# Altium schematic sheet 15fpga.SchDoc
size C
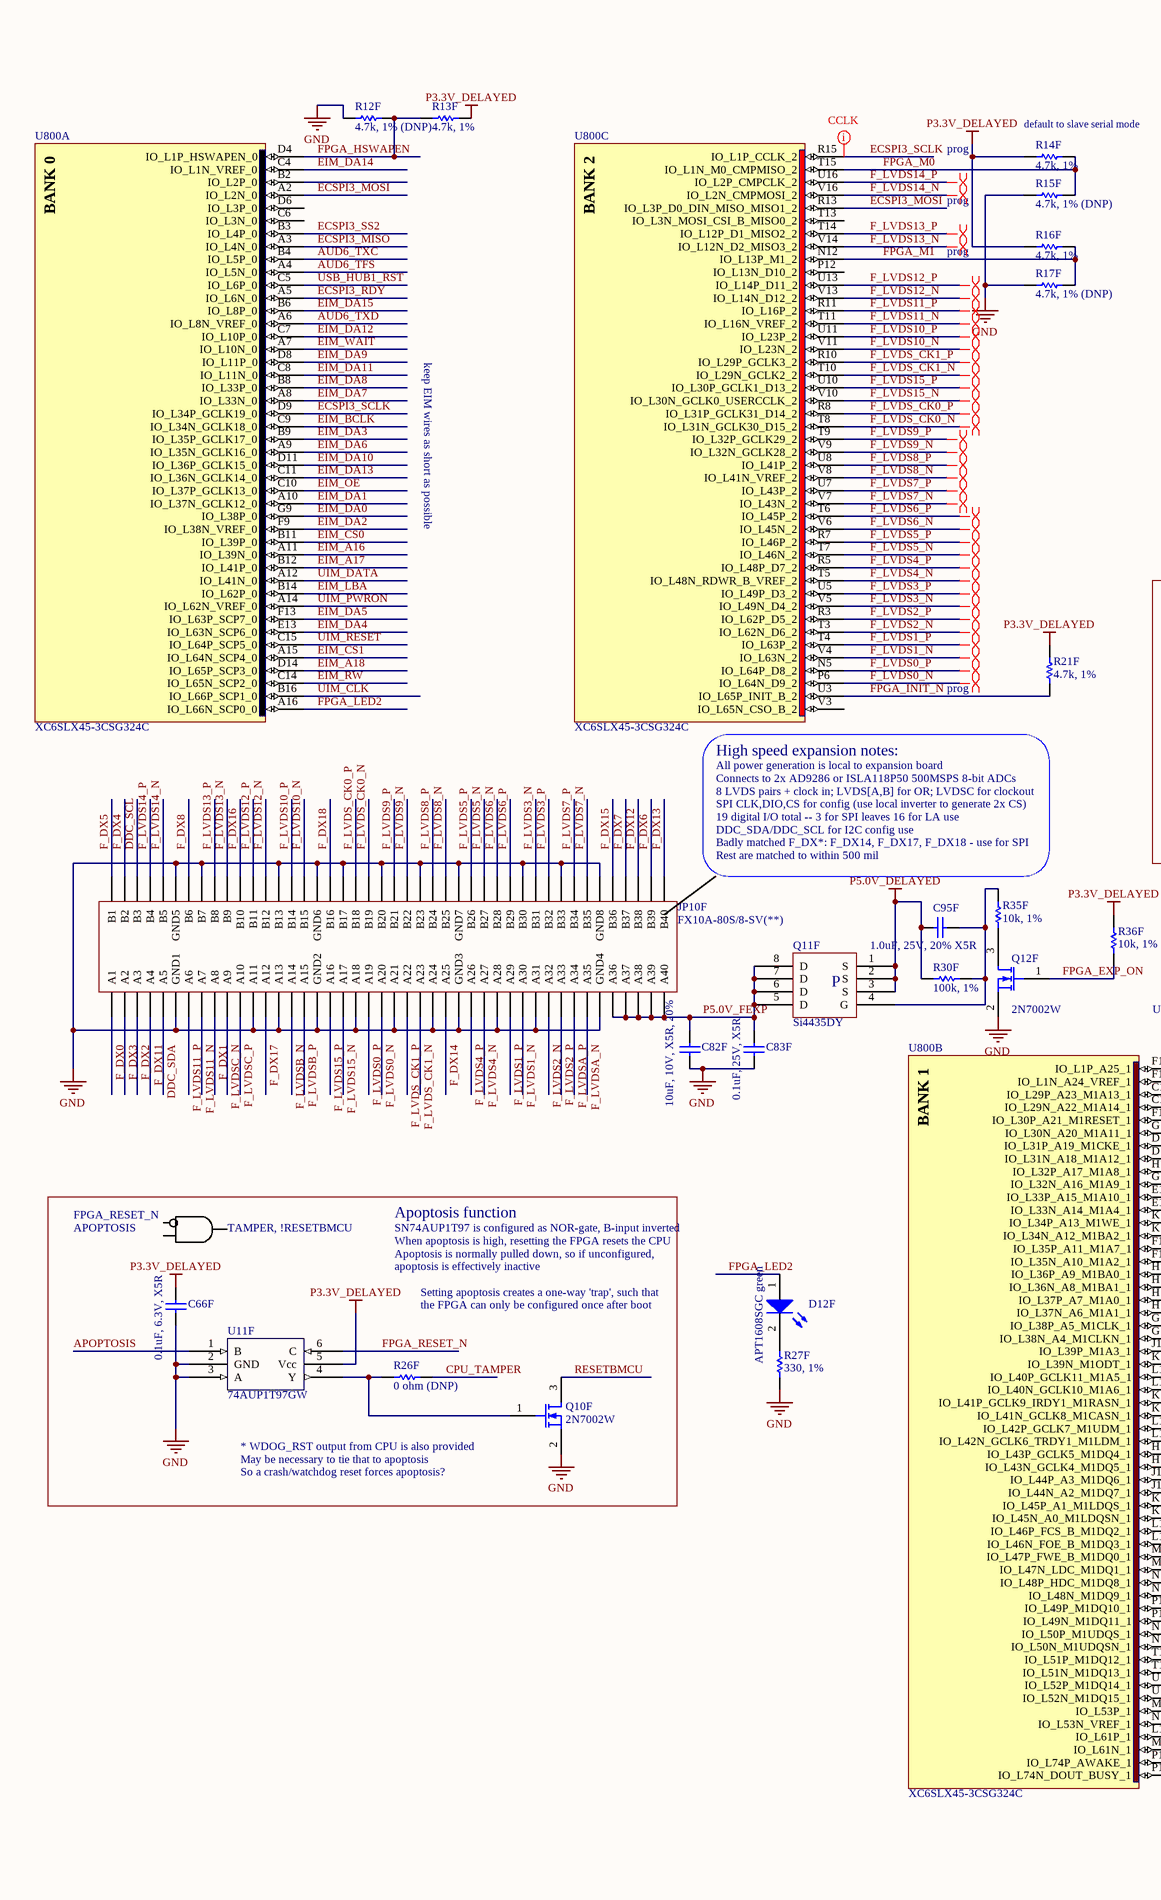
[diagram p0: 15fpga.SchDoc, left]
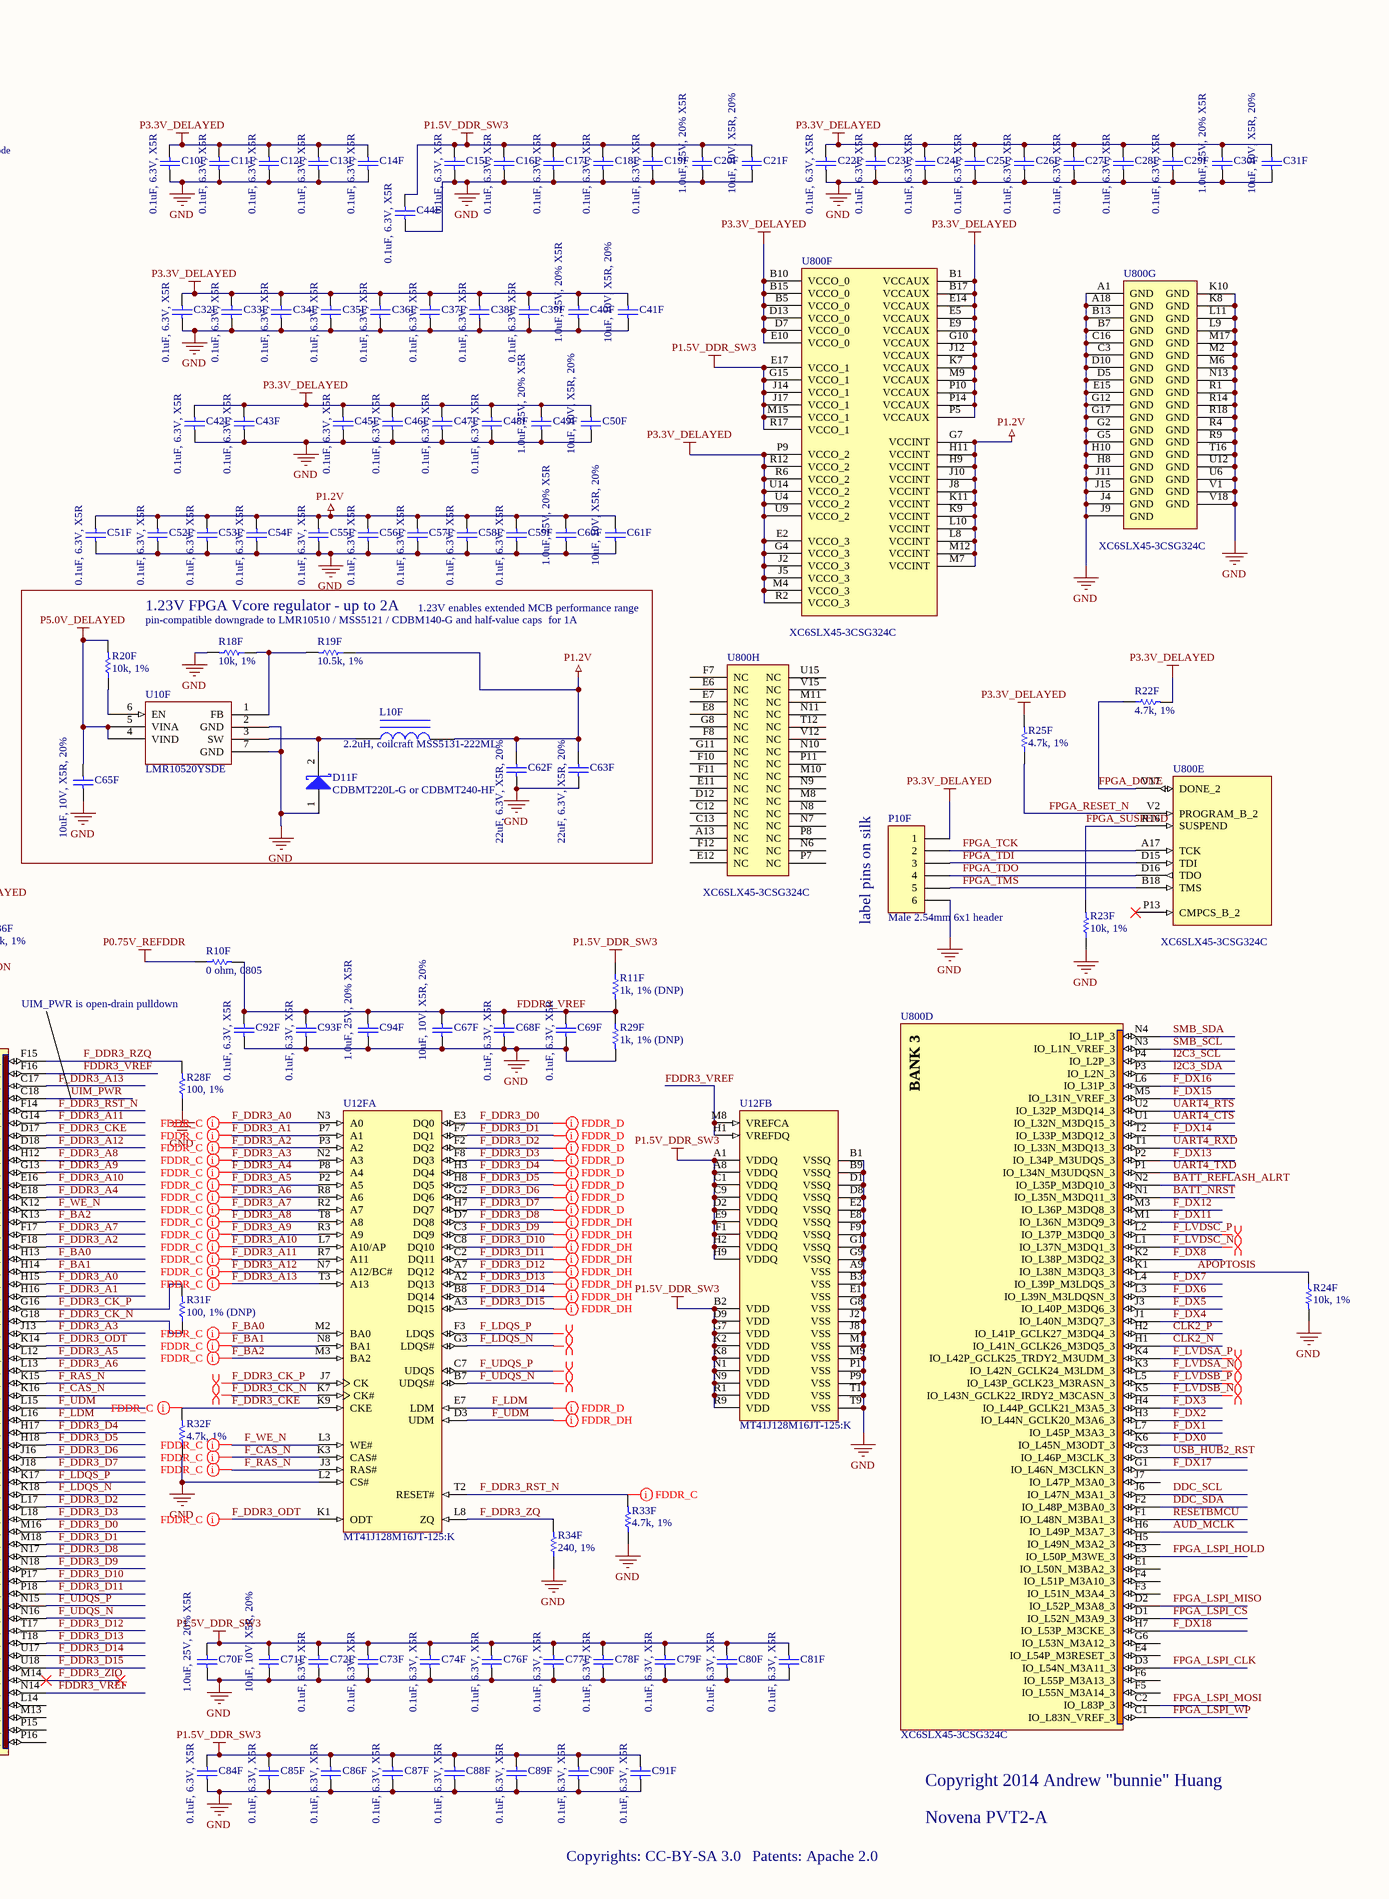
[diagram p1: 15fpga.SchDoc, right]

## Parts
C10F  0.1uF, 6.3V, X5R  [CAPC0603N_B]
C11F  0.1uF, 6.3V, X5R  [CAPC0603N_B]
C12F  0.1uF, 6.3V, X5R  [CAPC0603N_B]
C13F  0.1uF, 6.3V, X5R  [CAPC0603N_B]
C14F  0.1uF, 6.3V, X5R  [CAPC0603N_B]
C15F  0.1uF, 6.3V, X5R  [CAPC0603N_B]
C16F  0.1uF, 6.3V, X5R  [CAPC0603N_B]
C17F  0.1uF, 6.3V, X5R  [CAPC0603N_B]
C18F  0.1uF, 6.3V, X5R  [CAPC0603N_B]
C19F  0.1uF, 6.3V, X5R  [CAPC0603N_B]
C20F  1.0uF, 25V, 20% X5R  [CAPC1608N]
C21F  10uF, 10V, X5R, 20%  [CAPC1608N]
C22F  0.1uF, 6.3V, X5R  [CAPC0603N_B]
C23F  0.1uF, 6.3V, X5R  [CAPC0603N_B]
C24F  0.1uF, 6.3V, X5R  [CAPC0603N_B]
C25F  0.1uF, 6.3V, X5R  [CAPC0603N_B]
C26F  0.1uF, 6.3V, X5R  [CAPC0603N_B]
C27F  0.1uF, 6.3V, X5R  [CAPC0603N_B]
C28F  0.1uF, 6.3V, X5R  [CAPC0603N_B]
C29F  0.1uF, 6.3V, X5R  [CAPC0603N_B]
C30F  1.0uF, 25V, 20% X5R  [CAPC1608N]
C31F  10uF, 10V, X5R, 20%  [CAPC1608N]
C32F  0.1uF, 6.3V, X5R  [CAPC0603N_B]
C33F  0.1uF, 6.3V, X5R  [CAPC0603N_B]
C34F  0.1uF, 6.3V, X5R  [CAPC0603N_B]
C35F  0.1uF, 6.3V, X5R  [CAPC0603N_B]
C36F  0.1uF, 6.3V, X5R  [CAPC0603N_B]
C37F  0.1uF, 6.3V, X5R  [CAPC0603N_B]
C38F  0.1uF, 6.3V, X5R  [CAPC0603N_B]
C39F  0.1uF, 6.3V, X5R  [CAPC0603N_B]
C40F  1.0uF, 25V, 20% X5R  [CAPC1608N]
C41F  10uF, 10V, X5R, 20%  [CAPC1608N]
C42F  0.1uF, 6.3V, X5R  [CAPC0603N_B]
C43F  0.1uF, 6.3V, X5R  [CAPC0603N_B]
C44F  0.1uF, 6.3V, X5R  [CAPC0603N_B]
C45F  0.1uF, 6.3V, X5R  [CAPC0603N_B]
C46F  0.1uF, 6.3V, X5R  [CAPC0603N_B]
C47F  0.1uF, 6.3V, X5R  [CAPC0603N_B]
C48F  0.1uF, 6.3V, X5R  [CAPC0603N_B]
C49F  1.0uF, 25V, 20% X5R  [CAPC1608N]
C50F  10uF, 10V, X5R, 20%  [CAPC1608N]
C51F  0.1uF, 6.3V, X5R  [CAPC0603N_B]
C52F  0.1uF, 6.3V, X5R  [CAPC0603N_B]
C53F  0.1uF, 6.3V, X5R  [CAPC0603N_B]
C54F  0.1uF, 6.3V, X5R  [CAPC0603N_B]
C55F  0.1uF, 6.3V, X5R  [CAPC0603N_B]
C56F  0.1uF, 6.3V, X5R  [CAPC0603N_B]
C57F  0.1uF, 6.3V, X5R  [CAPC0603N_B]
C58F  0.1uF, 6.3V, X5R  [CAPC0603N_B]
C59F  0.1uF, 6.3V, X5R  [CAPC0603N_B]
C60F  1.0uF, 25V, 20% X5R  [CAPC1608N]
C61F  10uF, 10V, X5R, 20%  [CAPC1608N]
C62F  22uF, 6.3V, X5R, 20%  [CAPC1608N_HD]
C63F  22uF, 6.3V, X5R, 20%  [CAPC1608N_HD]
C65F  10uF, 10V, X5R, 20%  [CAPC1608N]
C66F  0.1uF, 6.3V, X5R  [CAPC0603N_B]
C67F  10uF, 10V, X5R, 20%  [CAPC1608N]
C68F  0.1uF, 6.3V, X5R  [CAPC0603N_B]
C69F  0.1uF, 6.3V, X5R  [CAPC0603N_B]
C70F  1.0uF, 25V, 20% X5R  [CAPC1608N]
C71F  10uF, 10V, X5R, 20%  [CAPC1608N]
C72F  0.1uF, 6.3V, X5R  [CAPC0603N_B]
C73F  0.1uF, 6.3V, X5R  [CAPC0603N_B]
C74F  0.1uF, 6.3V, X5R  [CAPC0603N_B]
C76F  0.1uF, 6.3V, X5R  [CAPC0603N_B]
C77F  0.1uF, 6.3V, X5R  [CAPC0603N_B]
C78F  0.1uF, 6.3V, X5R  [CAPC0603N_B]
C79F  0.1uF, 6.3V, X5R  [CAPC0603N_B]
C80F  0.1uF, 6.3V, X5R  [CAPC0603N_B]
C81F  0.1uF, 6.3V, X5R  [CAPC0603N_B]
C82F  10uF, 10V, X5R, 20%  [CAPC1608N]
C83F  0.1uF, 25V, X5R  [CAPC1005N]
C84F  0.1uF, 6.3V, X5R  [CAPC0603N_B]
C85F  0.1uF, 6.3V, X5R  [CAPC0603N_B]
C86F  0.1uF, 6.3V, X5R  [CAPC0603N_B]
C87F  0.1uF, 6.3V, X5R  [CAPC0603N_B]
C88F  0.1uF, 6.3V, X5R  [CAPC0603N_B]
C89F  0.1uF, 6.3V, X5R  [CAPC0603N_B]
C90F  0.1uF, 6.3V, X5R  [CAPC0603N_B]
C91F  0.1uF, 6.3V, X5R  [CAPC0603N_B]
C92F  0.1uF, 6.3V, X5R  [CAPC0603N_B]
C93F  0.1uF, 6.3V, X5R  [CAPC0603N_B]
C94F  1.0uF, 25V, 20% X5R  [CAPC1608N]
C95F  1.0uF, 25V, 20% X5R  [CAPC1608N]
D11F  CDBMT220L-G or CDBMT240-HF  [SOD123]
D12F  APT1608SGC green  [CD1608-0603]
JP10F  FX10A-80S/8-SV(**)  [HRS_FX10A-80S/8-SV1(**)]
L10F  2.2uH, coilcraft MSS5131-222ML  [COILCRAFT_MSS5121]
P10F  Male 2.54mm 6x1 header  [HDR1X6]
Q10F  2N7002W  [SOT323-3AN]
Q11F  Si4435DY  [SOIC127P600-8AN]
Q12F  2N7002W  [SOT323-3AN]
R10F  0 ohm, 0805  [RESC2012N]
R11F  1k, 1% (DNP)  [RESC1005N]
R12F  4.7k, 1% (DNP)  [RESC1005N]
R13F  4.7k, 1%  [RESC1005N]
R14F  4.7k, 1%  [RESC1005N]
R15F  4.7k, 1% (DNP)  [RESC1005N]
R16F  4.7k, 1%  [RESC1005N]
R17F  4.7k, 1% (DNP)  [RESC1005N]
R18F  10k, 1%  [RESC1005N]
R19F  10.5k, 1%  [RESC1005N]
R20F  10k, 1%  [RESC1005N]
R21F  4.7k, 1%  [RESC1005N]
R22F  4.7k, 1%  [RESC1005N]
R23F  10k, 1%  [RESC1005N]
R24F  10k, 1%  [RESC1005N]
R25F  4.7k, 1%  [RESC1005N]
R26F  0 ohm (DNP)  [RESC1005N]
R27F  330, 1%  [RESC1005N]
R28F  100, 1%  [RESC1005N]
R29F  1k, 1% (DNP)  [RESC1005N]
R30F  100k, 1%  [RESC1005N]
R31F  100, 1% (DNP)  [RESC1005N]
R32F  4.7k, 1%  [RESC1005N]
R33F  4.7k, 1%  [RESC1005N]
R34F  240, 1%  [RESC1005N]
R35F  10k, 1%  [RESC1005N]
R36F  10k, 1%  [RESC1005N]
U10F  LMR10520YSDE  [SON95P300X300X80-7V]
U11F  74AUP1T97GW  [SOT363-6N]
U12F  MT41J128M16JT-125:K  [MICT-HA-96]  (parts A,B of 3)
U800  XC6SLX45-3CSG324C  [CSG324]  (parts A,B,C,D,E,F,G,H of 8)

## Blocks framed on the sheet
1.23V FPGA Vcore regulator - up to 2A: C62F C63F C65F D11F L10F R18F R19F R20F U10F
Apoptosis function: C66F Q10F R26F U11F

## Nets
GND: C10F.2 C11F.2 C12F.2 C13F.2 C14F.2 C15F.2 C16F.2 C17F.2 C18F.2 C19F.2 C20F.1 C21F.2 C22F.2 C23F.2 C24F.2 C25F.2 C26F.2 C27F.2 C28F.2 C29F.2 C30F.1 C31F.2 C32F.2 C33F.2 C34F.2 C35F.2 C36F.2 C37F.2 C38F.2 C39F.2 C40F.1 C41F.2 C42F.2 C43F.2 C44F.2 C45F.2 C46F.2 C47F.2 C48F.2 C49F.1 C50F.2 C51F.2 C52F.2 C53F.2 C54F.2 C55F.2 C56F.2 C57F.2 C58F.2 C59F.2 C60F.1 C61F.2 C62F.2 C63F.2 C65F.1 C66F.2 C67F.2 C68F.2 C69F.2 C70F.1 C71F.2 C72F.2 C73F.2 C74F.2 C76F.2 C77F.2 C78F.2 C79F.2 C80F.2 C81F.2 C82F.1 C83F.2 C84F.2 C85F.2 C86F.2 C87F.2 C88F.2 C89F.2 C90F.2 C91F.2 C92F.2 C93F.2 C94F.1 D11F.1(A) JP10F.A11 JP10F.A13 JP10F.A18 JP10F.A21 JP10F.A24 JP10F.A28 JP10F.A31 JP10F.B7 JP10F.B13 JP10F.B17 JP10F.B20 JP10F.B23 JP10F.B30 JP10F.B33 JP10F.GND1 JP10F.GND2 JP10F.GND3 JP10F.GND4 JP10F.GND5 JP10F.GND6 JP10F.GND7 JP10F.GND8 P10F.6 Q10F.2(S) Q12F.2(S) R12F.1 R15F.1 R17F.1 R18F.2 R23F.1 R24F.2 R27F.1 R28F.1 R29F.2 R32F.1 R33F.1 R34F.1 U10F.2(GND) U10F.7(GND) U11F.2(GND) U11F.3(A) U12F.A9(VSS) U12F.B1(VSSQ) U12F.B3(VSS) U12F.B9(VSSQ) U12F.D1(VSSQ) U12F.D8(VSSQ) U12F.E1(VSS) U12F.E2(VSSQ) U12F.E8(VSSQ) U12F.F9(VSSQ) U12F.G1(VSSQ) U12F.G8(VSS) U12F.G9(VSSQ) U12F.J2(VSS) U12F.J8(VSS) U12F.L2(CS#) U12F.M1(VSS) U12F.M9(VSS) U12F.P1(VSS) U12F.P9(VSS) U12F.T1(VSS) U12F.T9(VSS) U800.A1(GND) U800.A18(GND) U800.B7(GND) U800.B13(GND) U800.C3(GND) U800.C16(GND) U800.D5(GND) U800.D10(GND) U800.E15(GND) U800.G2(GND) U800.G5(GND) U800.G12(GND) U800.G17(GND) U800.H8(GND) U800.H10(GND) U800.J4(GND) U800.J9(GND) U800.J11(GND) U800.J15(GND) U800.K8(GND) U800.K10(GND) U800.L9(GND) U800.L11(GND) U800.M2(GND) U800.M6(GND) U800.M17(GND) U800.N13(GND) U800.R1(GND) U800.R4(GND) U800.R9(GND) U800.R14(GND) U800.R18(GND) U800.T16(GND) U800.U6(GND) U800.U12(GND) U800.V1(GND) U800.V18(GND)
P0.75V_REFDDR: R10F.1
P1.2V: C51F.1 C52F.1 C53F.1 C54F.1 C55F.1 C56F.1 C57F.1 C58F.1 C59F.1 C60F.2 C61F.1 C62F.1 C63F.1 L10F.2 R19F.1 U800.G7(VCCINT) U800.H9(VCCINT) U800.H11(VCCINT) U800.J8(VCCINT) U800.J10(VCCINT) U800.K9(VCCINT) U800.K11(VCCINT) U800.L8(VCCINT) U800.L10(VCCINT) U800.M7(VCCINT) U800.M12(VCCINT)
P1.5V_DDR_SW3: C15F.1 C16F.1 C17F.1 C18F.1 C19F.1 C20F.2 C21F.1 C44F.1 C70F.2 C71F.1 C72F.1 C73F.1 C74F.1 C76F.1 C77F.1 C78F.1 C79F.1 C80F.1 C81F.1 C84F.1 C85F.1 C86F.1 C87F.1 C88F.1 C89F.1 C90F.1 C91F.1 R11F.1 U12F.A1(VDDQ) U12F.A8(VDDQ) U12F.B2(VDD) U12F.C1(VDDQ) U12F.C9(VDDQ) U12F.D2(VDDQ) U12F.D9(VDD) U12F.E9(VDDQ) U12F.F1(VDDQ) U12F.G7(VDD) U12F.H2(VDDQ) U12F.H9(VDDQ) U12F.K2(VDD) U12F.K8(VDD) U12F.N1(VDD) U12F.N9(VDD) U12F.R1(VDD) U12F.R9(VDD) U800.E17(VCCO_1) U800.G15(VCCO_1) U800.J14(VCCO_1) U800.J17(VCCO_1) U800.M15(VCCO_1) U800.R17(VCCO_1)
P3.3V_DELAYED: C10F.1 C11F.1 C12F.1 C13F.1 C14F.1 C22F.1 C23F.1 C24F.1 C25F.1 C26F.1 C27F.1 C28F.1 C29F.1 C30F.2 C31F.1 C32F.1 C33F.1 C34F.1 C35F.1 C36F.1 C37F.1 C38F.1 C39F.1 C40F.2 C41F.1 C42F.1 C43F.1 C45F.1 C46F.1 C47F.1 C48F.1 C49F.2 C50F.1 C66F.1 P10F.1 R13F.2 R14F.1 R16F.1 R21F.1 R22F.2 R25F.2 R36F.1 U11F.5(Vcc) U800.B1(VCCAUX) U800.B5(VCCO_0) U800.B10(VCCO_0) U800.B15(VCCO_0) U800.B17(VCCAUX) U800.D7(VCCO_0) U800.D13(VCCO_0) U800.E2(VCCO_3) U800.E5(VCCAUX) U800.E9(VCCAUX) U800.E10(VCCO_0) U800.E14(VCCAUX) U800.G4(VCCO_3) U800.G10(VCCAUX) U800.J2(VCCO_3) U800.J5(VCCO_3) U800.J12(VCCAUX) U800.K7(VCCAUX) U800.M4(VCCO_3) U800.M9(VCCAUX) U800.P5(VCCAUX) U800.P9(VCCO_2) U800.P10(VCCAUX) U800.P14(VCCAUX) U800.R2(VCCO_3) U800.R6(VCCO_2) U800.R12(VCCO_2) U800.U4(VCCO_2) U800.U9(VCCO_2) U800.U14(VCCO_2)
P5.0V_DELAYED: C65F.2 C95F.1 Q11F.1(S) Q11F.2(S) Q11F.3(S) R20F.2 R30F.2 U10F.4(VIND) U10F.5(VINA)
APOPTOSIS: R24F.1 U11F.1(B) U800.K1(IO_L38N_M3DQ3_3)
AUD6_TFS: U800.A4(IO_L5N_0)
AUD6_TXC: U800.B4(IO_L5P_0)
AUD6_TXD: U800.A6(IO_L8N_VREF_0)
AUD_MCLK: U800.H6(IO_L49P_M3A7_3)
BATT_NRST: U800.N1(IO_L35N_M3DQ11_3)
BATT_REFLASH_ALRT: U800.N2(IO_L35P_M3DQ10_3)
CLK2_N: U800.H1(IO_L41N_GCLK26_M3DQ5_3)
CLK2_P: U800.H2(IO_L41P_GCLK27_M3DQ4_3)
CPU_TAMPER: R26F.2
DDC_SCL: JP10F.B3 U800.J6(IO_L47N_M3A1_3)
DDC_SDA: JP10F.A5 U800.F2(IO_L48P_M3BA0_3)
ECSPI3_MISO: U800.A3(IO_L4N_0)
ECSPI3_MOSI: U800.A2(IO_L2N_0) U800.R13(IO_L3P_D0_DIN_MISO_MISO1_2)
ECSPI3_RDY: U800.A5(IO_L6N_0)
ECSPI3_SCLK: U800.D9(IO_L34P_GCLK19_0) U800.R15(IO_L1P_CCLK_2)
ECSPI3_SS2: U800.B3(IO_L4P_0)
EIM_A16: U800.A11(IO_L39N_0)
EIM_A17: U800.B12(IO_L41P_0)
EIM_A18: U800.D14(IO_L65P_SCP3_0)
EIM_BCLK: U800.C9(IO_L34N_GCLK18_0)
EIM_CS0: U800.B11(IO_L39P_0)
EIM_CS1: U800.A15(IO_L64N_SCP4_0)
EIM_DA0: U800.G9(IO_L38P_0)
EIM_DA1: U800.A10(IO_L37N_GCLK12_0)
EIM_DA2: U800.F9(IO_L38N_VREF_0)
EIM_DA3: U800.B9(IO_L35P_GCLK17_0)
EIM_DA4: U800.E13(IO_L63N_SCP6_0)
EIM_DA5: U800.F13(IO_L63P_SCP7_0)
EIM_DA6: U800.A9(IO_L35N_GCLK16_0)
EIM_DA7: U800.A8(IO_L33N_0)
EIM_DA8: U800.B8(IO_L33P_0)
EIM_DA9: U800.D8(IO_L11P_0)
EIM_DA10: U800.D11(IO_L36P_GCLK15_0)
EIM_DA11: U800.C8(IO_L11N_0)
EIM_DA12: U800.C7(IO_L10P_0)
EIM_DA13: U800.C11(IO_L36N_GCLK14_0)
EIM_DA14: U800.C4(IO_L1N_VREF_0)
EIM_DA15: U800.B6(IO_L8P_0)
EIM_LBA: U800.B14(IO_L62P_0)
EIM_OE: U800.C10(IO_L37P_GCLK13_0)
EIM_RW: U800.C14(IO_L65N_SCP2_0)
EIM_WAIT: U800.A7(IO_L10N_0)
F_BA0: U12F.M2(BA0) U800.H13(IO_L36P_A9_M1BA0_1)
F_BA1: U12F.N8(BA1) U800.H14(IO_L36N_A8_M1BA1_1)
F_BA2: U12F.M3(BA2) U800.K13(IO_L34N_A12_M1BA2_1)
F_CAS_N: U12F.K3(CAS#) U800.K16(IO_L41N_GCLK8_M1CASN_1)
F_DDR3_A0: U12F.N3(A0) U800.H15(IO_L37P_A7_M1A0_1)
F_DDR3_A1: U12F.P7(A1) U800.H16(IO_L37N_A6_M1A1_1)
F_DDR3_A2: U12F.P3(A2) U800.F18(IO_L35N_A10_M1A2_1)
F_DDR3_A3: U12F.N2(A3) U800.J13(IO_L39P_M1A3_1)
F_DDR3_A4: U12F.P8(A4) U800.E18(IO_L33N_A14_M1A4_1)
F_DDR3_A5: U12F.P2(A5) U800.L12(IO_L40P_GCLK11_M1A5_1)
F_DDR3_A6: U12F.R8(A6) U800.L13(IO_L40N_GCLK10_M1A6_1)
F_DDR3_A7: U12F.R2(A7) U800.F17(IO_L35P_A11_M1A7_1)
F_DDR3_A8: U12F.T8(A8) U800.H12(IO_L32P_A17_M1A8_1)
F_DDR3_A9: U12F.R3(A9) U800.G13(IO_L32N_A16_M1A9_1)
F_DDR3_A10: U12F.L7(A10/AP) U800.E16(IO_L33P_A15_M1A10_1)
F_DDR3_A11: U12F.R7(A11) U800.G14(IO_L30N_A20_M1A11_1)
F_DDR3_A12: U12F.N7(A12/BC#) U800.D18(IO_L31N_A18_M1A12_1)
F_DDR3_A13: U12F.T3(A13) U800.C17(IO_L29P_A23_M1A13_1)
F_DDR3_CK_N: R31F.1 U12F.K7(CK#) U800.G18(IO_L38N_A4_M1CLKN_1)
F_DDR3_CK_P: R31F.2 U12F.J7(CK) U800.G16(IO_L38P_A5_M1CLK_1)
F_DDR3_CKE: R32F.2 U12F.K9(CKE) U800.D17(IO_L31P_A19_M1CKE_1)
F_DDR3_D0: U12F.E3(DQ0) U800.M16(IO_L47P_FWE_B_M1DQ0_1)
F_DDR3_D1: U12F.F7(DQ1) U800.M18(IO_L47N_LDC_M1DQ1_1)
F_DDR3_D2: U12F.F2(DQ2) U800.L17(IO_L46P_FCS_B_M1DQ2_1)
F_DDR3_D3: U12F.F8(DQ3) U800.L18(IO_L46N_FOE_B_M1DQ3_1)
F_DDR3_D4: U12F.H3(DQ4) U800.H17(IO_L43P_GCLK5_M1DQ4_1)
F_DDR3_D5: U12F.H8(DQ5) U800.H18(IO_L43N_GCLK4_M1DQ5_1)
F_DDR3_D6: U12F.G2(DQ6) U800.J16(IO_L44P_A3_M1DQ6_1)
F_DDR3_D7: U12F.H7(DQ7) U800.J18(IO_L44N_A2_M1DQ7_1)
F_DDR3_D8: U12F.D7(DQ8) U800.N17(IO_L48P_HDC_M1DQ8_1)
F_DDR3_D9: U12F.C3(DQ9) U800.N18(IO_L48N_M1DQ9_1)
F_DDR3_D10: U12F.C8(DQ10) U800.P17(IO_L49P_M1DQ10_1)
F_DDR3_D11: U12F.C2(DQ11) U800.P18(IO_L49N_M1DQ11_1)
F_DDR3_D12: U12F.A7(DQ12) U800.T17(IO_L51P_M1DQ12_1)
F_DDR3_D13: U12F.A2(DQ13) U800.T18(IO_L51N_M1DQ13_1)
F_DDR3_D14: U12F.B8(DQ14) U800.U17(IO_L52P_M1DQ14_1)
F_DDR3_D15: U12F.A3(DQ15) U800.U18(IO_L52N_M1DQ15_1)
F_DDR3_ODT: U12F.K1(ODT) U800.K14(IO_L39N_M1ODT_1)
F_DDR3_RST_N: R33F.2 U12F.T2(RESET#) U800.F14(IO_L30P_A21_M1RESET_1)
F_DDR3_RZQ: R28F.2 U800.F15(IO_L1P_A25_1)
F_DDR3_ZIO: U800.M14(IO_L53P_1)
F_DDR3_ZQ: R34F.2 U12F.L8(ZQ)
F_DX0: JP10F.A1 U800.K6(IO_L45N_M3ODT_3)
F_DX1: JP10F.A8 U800.L7(IO_L45P_M3A3_3)
F_DX2: JP10F.A3 U800.H3(IO_L44N_GCLK20_M3A6_3)
F_DX3: JP10F.A2 U800.H4(IO_L44P_GCLK21_M3A5_3)
F_DX4: JP10F.B2 U800.J1(IO_L40N_M3DQ7_3)
F_DX5: JP10F.B1 U800.J3(IO_L40P_M3DQ6_3)
F_DX6: JP10F.B39 U800.L3(IO_L39N_M3LDQSN_3)
F_DX7: JP10F.B37 U800.L4(IO_L39P_M3LDQS_3)
F_DX8: JP10F.B6 U800.K2(IO_L38P_M3DQ2_3)
F_DX11: JP10F.A4 U800.M1(IO_L36N_M3DQ9_3)
F_DX12: JP10F.B38 U800.M3(IO_L36P_M3DQ8_3)
F_DX13: JP10F.B40 U800.P2(IO_L34P_M3UDQS_3)
F_DX14: JP10F.A25 U800.T2(IO_L33P_M3DQ12_3)
F_DX15: JP10F.B36 U800.M5(IO_L31N_VREF_3)
F_DX16: JP10F.B10 U800.L6(IO_L31P_3)
F_DX17: JP10F.A12 U800.G1(IO_L46N_M3CLKN_3)
F_DX18: JP10F.B16 U800.H7(IO_L53P_M3CKE_3)
F_LDM: U12F.E7(LDM) U800.L16(IO_L42N_GCLK6_TRDY1_M1LDM_1)
F_LDQS_N: U12F.G3(LDQS#) U800.K18(IO_L45N_A0_M1LDQSN_1)
F_LDQS_P: U12F.F3(LDQS) U800.K17(IO_L45P_A1_M1LDQS_1)
F_LVDS0_N: JP10F.A20 U800.P6(IO_L64N_D9_2)
F_LVDS0_P: JP10F.A19 U800.N5(IO_L64P_D8_2)
F_LVDS1_N: JP10F.A30 U800.V4(IO_L63N_2)
F_LVDS1_P: JP10F.A29 U800.T4(IO_L63P_2)
F_LVDS2_N: JP10F.A32 U800.T3(IO_L62N_D6_2)
F_LVDS2_P: JP10F.A33 U800.R3(IO_L62P_D5_2)
F_LVDS3_N: JP10F.B31 U800.V5(IO_L49N_D4_2)
F_LVDS3_P: JP10F.B32 U800.U5(IO_L49P_D3_2)
F_LVDS4_N: JP10F.A27 U800.T5(IO_L48N_RDWR_B_VREF_2)
F_LVDS4_P: JP10F.A26 U800.R5(IO_L48P_D7_2)
F_LVDS5_N: JP10F.B27 U800.T7(IO_L46N_2)
F_LVDS5_P: JP10F.B26 U800.R7(IO_L46P_2)
F_LVDS6_N: JP10F.B28 U800.V6(IO_L45N_2)
F_LVDS6_P: JP10F.B29 U800.T6(IO_L45P_2)
F_LVDS7_N: JP10F.B35 U800.V7(IO_L43N_2)
F_LVDS7_P: JP10F.B34 U800.U7(IO_L43P_2)
F_LVDS8_N: JP10F.B25 U800.V8(IO_L41N_VREF_2)
F_LVDS8_P: JP10F.B24 U800.U8(IO_L41P_2)
F_LVDS9_N: JP10F.B22 U800.V9(IO_L32N_GCLK28_2)
F_LVDS9_P: JP10F.B21 U800.T9(IO_L32P_GCLK29_2)
F_LVDS10_N: JP10F.B15 U800.V11(IO_L23N_2)
F_LVDS10_P: JP10F.B14 U800.U11(IO_L23P_2)
F_LVDS11_N: JP10F.A7 U800.T11(IO_L16N_VREF_2)
F_LVDS11_P: JP10F.A6 U800.R11(IO_L16P_2)
F_LVDS12_N: JP10F.B12 U800.V13(IO_L14N_D12_2)
F_LVDS12_P: JP10F.B11 U800.U13(IO_L14P_D11_2)
F_LVDS13_N: JP10F.B9 U800.V14(IO_L12N_D2_MISO3_2)
F_LVDS13_P: JP10F.B8 U800.T14(IO_L12P_D1_MISO2_2)
F_LVDS14_N: JP10F.B5 U800.V16(IO_L2N_CMPMOSI_2)
F_LVDS14_P: JP10F.B4 U800.U16(IO_L2P_CMPCLK_2)
F_LVDS15_N: JP10F.A17 U800.V10(IO_L30N_GCLK0_USERCCLK_2)
F_LVDS15_P: JP10F.A16 U800.U10(IO_L30P_GCLK1_D13_2)
F_LVDS_CK0_N: JP10F.B19 U800.T8(IO_L31N_GCLK30_D15_2)
F_LVDS_CK0_P: JP10F.B18 U800.R8(IO_L31P_GCLK31_D14_2)
F_LVDS_CK1_N: JP10F.A23 U800.T10(IO_L29N_GCLK2_2)
F_LVDS_CK1_P: JP10F.A22 U800.R10(IO_L29P_GCLK3_2)
F_LVDSA_N: JP10F.A35 U800.K3(IO_L42N_GCLK24_M3LDM_3)
F_LVDSA_P: JP10F.A34 U800.K4(IO_L42P_GCLK25_TRDY2_M3UDM_3)
F_LVDSB_N: JP10F.A14 U800.K5(IO_L43N_GCLK22_IRDY2_M3CASN_3)
F_LVDSB_P: JP10F.A15 U800.L5(IO_L43P_GCLK23_M3RASN_3)
F_LVDSC_N: JP10F.A9 U800.L1(IO_L37N_M3DQ1_3)
F_LVDSC_P: JP10F.A10 U800.L2(IO_L37P_M3DQ0_3)
F_RAS_N: U12F.J3(RAS#) U800.K15(IO_L41P_GCLK9_IRDY1_M1RASN_1)
F_UDM: U12F.D3(UDM) U800.L15(IO_L42P_GCLK7_M1UDM_1)
F_UDQS_N: U12F.B7(UDQS#) U800.N16(IO_L50N_M1UDQSN_1)
F_UDQS_P: U12F.C7(UDQS) U800.N15(IO_L50P_M1UDQS_1)
F_WE_N: U12F.L3(WE#) U800.K12(IO_L34P_A13_M1WE_1)
FDDR3_VREF: C67F.1 C68F.1 C69F.1 C92F.1 C93F.1 C94F.2 R10F.2 R11F.2 R29F.1 U12F.H1(VREFDQ) U12F.M8(VREFCA) U800.F16(IO_L1N_A24_VREF_1) U800.N14(IO_L53N_VREF_1)
FPGA_DONE: R22F.1 U800.V17(DONE_2)
FPGA_EXP_ON: Q12F.1(G) R36F.2
FPGA_HSWAPEN: R12F.2 R13F.1 U800.D4(IO_L1P_HSWAPEN_0)
FPGA_INIT_N: R21F.2 U800.U3(IO_L65P_INIT_B_2)
FPGA_LED2: D12F.1(A) U800.A16(IO_L66N_SCP0_0)
FPGA_LSPI_CLK: U800.D3(IO_L54N_M3A11_3)
FPGA_LSPI_CS: U800.D1(IO_L52N_M3A9_3)
FPGA_LSPI_HOLD: U800.E3(IO_L50P_M3WE_3)
FPGA_LSPI_MISO: U800.D2(IO_L52P_M3A8_3)
FPGA_LSPI_MOSI: U800.C2(IO_L83P_3)
FPGA_LSPI_WP: U800.C1(IO_L83N_VREF_3)
FPGA_M0: R14F.2 R15F.2 U800.T15(IO_L1N_M0_CMPMISO_2)
FPGA_M1: R16F.2 R17F.2 U800.N12(IO_L13P_M1_2)
FPGA_RESET_N: R25F.1 U11F.6(C) U800.V2(PROGRAM_B_2)
FPGA_SUSPEND: R23F.2 U800.R16(SUSPEND)
FPGA_TCK: P10F.2 U800.A17(TCK)
FPGA_TDI: P10F.3 U800.D15(TDI)
FPGA_TDO: P10F.4 U800.D16(TDO)
FPGA_TMS: P10F.5 U800.B18(TMS)
I2C3_SCL: U800.P4(IO_L2P_3)
I2C3_SDA: U800.P3(IO_L2N_3)
P5.0V_FEXP: C82F.2 C83F.1 JP10F.A36 JP10F.A37 JP10F.A38 JP10F.A39 JP10F.A40 Q11F.5(D) Q11F.6(D) Q11F.7(D) Q11F.8(D)
RESETBMCU: Q10F.3(D) U800.F1(IO_L48N_M3BA1_3)
SMB_SCL: U800.N3(IO_L1N_VREF_3)
SMB_SDA: U800.N4(IO_L1P_3)
UART4_CTS: U800.U1(IO_L32N_M3DQ15_3)
UART4_RTS: U800.U2(IO_L32P_M3DQ14_3)
UART4_RXD: U800.T1(IO_L33N_M3DQ13_3)
UART4_TXD: U800.P1(IO_L34N_M3UDQSN_3)
UIM_CLK: U800.B16(IO_L66P_SCP1_0)
UIM_DATA: U800.A12(IO_L41N_0)
UIM_PWR: U800.C18(IO_L29N_A22_M1A14_1)
UIM_PWRON: U800.A14(IO_L62N_VREF_0)
UIM_RESET: U800.C15(IO_L64P_SCP5_0)
USB_HUB1_RST: U800.C5(IO_L6P_0)
USB_HUB2_RST: U800.G3(IO_L46P_M3CLK_3)
NetC95F_2: C95F.2 Q11F.4(G) R30F.1 R35F.1
NetD11F_2: D11F.2(K) L10F.1 U10F.3(SW)
NetD12F_2: D12F.2(K) R27F.2
NetQ10F_1: Q10F.1(G) R26F.1 U11F.4(Y)
NetQ12F_3: Q12F.3(D) R35F.2
NetR18F_1: R18F.1 R19F.2 U10F.1(FB)
NetR20F_1: R20F.1 U10F.6(EN)

Not connected (* = marked no-connect by the designer): U800 A13(NC) B2(IO_L2P_0) C6(IO_L3N_0) C12(NC) C13(NC) D6(IO_L3P_0) D12(NC) E1(IO_L50N_M3BA2_3) E4(IO_L54P_M3RESET_3) E6(NC) E7(NC) E8(NC) E11(NC) E12(NC) F3(IO_L51N_M3A4_3) F4(IO_L51P_M3A10_3) F5(IO_L55N_M3A14_3) F6(IO_L55P_M3A13_3) F7(NC) F8(NC) F10(NC) F11(NC) F12(NC) G6(IO_L53N_M3A12_3) G8(NC) G11(NC) H5(IO_L49N_M3A2_3) J7(IO_L47P_M3A0_3) L14(IO_L61P_1) M8(NC) M10(NC) M11(NC) M13(IO_L61N_1) N6(NC) N7(NC) N8(NC) N9(NC) N10(NC) N11(NC) P7(NC) P8(NC) P11(NC) P12(IO_L13N_D10_2) P13(CMPCS_B_2)* P15(IO_L74P_AWAKE_1) P16(IO_L74N_DOUT_BUSY_1) T12(NC) T13(IO_L3N_MOSI_CSI_B_MISO0_2) U15(NC) V3(IO_L65N_CSO_B_2) V12(NC) V15(NC)

## Layout directives
net class CCLK: ECSPI3_SCLK
differential pair: F_DDR3_CK_N, F_DDR3_CK_P, F_LDQS_N, F_LDQS_P, F_LVDS0_N, F_LVDS0_P, F_LVDS1_N, F_LVDS1_P, F_LVDS2_N, F_LVDS2_P, F_LVDS3_N, F_LVDS3_P, F_LVDS4_N, F_LVDS4_P, F_LVDS5_N, F_LVDS5_P, F_LVDS6_N, F_LVDS6_P, F_LVDS7_N, F_LVDS7_P, F_LVDS8_N, F_LVDS8_P, F_LVDS9_N, F_LVDS9_P, F_LVDS10_N, F_LVDS10_P, F_LVDS11_N, F_LVDS11_P, F_LVDS12_N, F_LVDS12_P, F_LVDS13_N, F_LVDS13_P, F_LVDS14_N, F_LVDS14_P, F_LVDS15_N, F_LVDS15_P, F_LVDS_CK0_N, F_LVDS_CK0_P, F_LVDS_CK1_N, F_LVDS_CK1_P, F_LVDSA_N, F_LVDSA_P, F_LVDSB_N, F_LVDSB_P, F_LVDSC_N, F_LVDSC_P, F_UDQS_N, F_UDQS_P
net class FDDR_D: F_DDR3_D0, F_DDR3_D1, F_DDR3_D2, F_DDR3_D3, F_DDR3_D4, F_DDR3_D5, F_DDR3_D6, F_DDR3_D7, F_LDM
net class FDDR_DH: F_DDR3_D8, F_DDR3_D9, F_DDR3_D10, F_DDR3_D11, F_DDR3_D12, F_DDR3_D13, F_DDR3_D14, F_DDR3_D15, F_UDM
net class FDDR_C: F_BA0, F_BA1, F_BA2, F_CAS_N, F_DDR3_A0, F_DDR3_A1, F_DDR3_A2, F_DDR3_A3, F_DDR3_A4, F_DDR3_A5, F_DDR3_A6, F_DDR3_A7, F_DDR3_A8, F_DDR3_A9, F_DDR3_A10, F_DDR3_A11, F_DDR3_A12, F_DDR3_A13, F_DDR3_CKE, F_DDR3_ODT, F_DDR3_RST_N, F_RAS_N, F_WE_N

## Notes on the sheet
- (near R14F) default to slave serial mode
- prog
- keep EIM wires as short as possible
- pin-compatible downgrade to LMR10510 / MSS5121 / CDBM140-G and half-value caps  for 1A
- 1.23V enables extended MCB performance range
- All power generation is local to expansion board
- (near U800) High speed expansion notes:
- Connects to 2x AD9286 or ISLA118P50 500MSPS 8-bit ADCs
- 8 LVDS pairs + clock in; LVDS[A,B] for OR; LVDSC for clockout
- SPI CLK,DIO,CS for config (use local inverter to generate 2x CS)
- 19 digital I/O total -- 3 for SPI leaves 16 for LA use
- DDC_SDA/DDC_SCL for I2C config use
- Badly matched F_DX*: F_DX14, F_DX17, F_DX18 - use for SPI
- Rest are matched to within 500 mil
- label pins on silk
- UIM_PWR is open-drain pulldown
- FPGA_RESET_N
- APOPTOSIS
- TAMPER, !RESETBMCU
- SN74AUP1T97 is configured as NOR-gate, B-input inverted
- When apoptosis is high, resetting the FPGA resets the CPU
- Apoptosis is normally pulled down, so if unconfigured,
- apoptosis is effectively inactive
- Setting apoptosis creates a one-way 'trap', such that
- the FPGA can only be configured once after boot
- * WDOG_RST output from CPU is also provided
- May be necessary to tie that to apoptosis
- So a crash/watchdog reset forces apoptosis?
- Copyright 2014 Andrew "bunnie" Huang
- Novena PVT2-A
- Copyrights: CC-BY-SA 3.0
- Patents: Apache 2.0
- (in symbol Si4435DY) P
- (in symbol XC6SLX9-2CSG324C, part A) BANK 0
- (in symbol XC6SLX9-2CSG324C, part B) BANK 1
- (in symbol XC6SLX9-2CSG324C, part C) BANK 2
- (in symbol XC6SLX9-2CSG324C, part D) BANK 3

## Library data of the parts
C10F C11F C12F C13F C14F C15F C16F C17F C18F C19F C20F C21F C22F C23F C24F C25F C26F C27F C28F C29F C30F C31F C32F C33F C34F C35F C36F C37F C38F C39F C40F C41F C42F C43F C44F C45F C46F C47F C48F C49F C50F C51F C52F C53F C54F C55F C56F C57F C58F C59F C60F C61F C62F C63F C65F C66F C67F C68F C69F C70F C71F C72F C73F C74F C76F C77F C78F C79F C80F C81F C82F C83F C84F C85F C86F C87F C88F C89F C90F C91F C92F C93F C94F C95F = Cap Semi: Capacitor (Semiconductor SIM Model); Published: 8-Jun-2000; LatestRevisionDate: 17-Jul-2002; LatestRevisionNote: Re-released for DXP Platform.; PackageReference: C1206; Publisher: Altium Limited
D11F = D Schottky: Schottky Diode; Code - JEDEC: DO-214-AA; Published: 8-Jun-2000; Publisher: Altium Limited; Revision: July-2002: Re-released for DXP Platform.
D12F = LED2: Typical RED, GREEN, YELLOW, AMBER GaAs LED; Published: 8-Jun-2000; LatestRevisionDate: 17-Jul-2002; LatestRevisionNote: Re-released for DXP Platform.; PackageVersion: Feb-2002; PackageReference: 3.2X1.6X1.1; Publisher: Altium Limited
JP10F = HEADER_HRS_FX10A_80: 80-pin 10Gbps 5mm mated height board-to-board connector
L10F = Inductor Iron: Magnetic-Core Inductor; Published: 24-Mar-1999; LatestRevisionDate: 17-Jul-2002; LatestRevisionNote: Re-released for DXP Platform.; PackageReference: AXIAL-0.9; Publisher: Altium Limited
P10F = Header 6: Header, 6-Pin; LatestRevisionDate: 17-Jul-2002; LatestRevisionNote: Re-released for DXP Platform.; Publisher: Altium Limited
Q10F Q12F = MOSFET-N: N-Channel MOSFET; Published: 8-Jun-2000; LatestRevisionDate: 17-Jul-2002; LatestRevisionNote: Re-released for DXP Platform.; PackageVersion: 1995/1996; PackageReference: E3; Publisher: Altium Limited
Q11F = Si4435DY: Singre P-channel FET, 8A, 30V
R10F R11F R12F R13F R14F R15F R16F R17F R18F R19F R20F R21F R22F R23F R24F R25F R26F R27F R28F R29F R31F R32F R33F R34F R35F R36F = Res1: Resistor; Value: 100k; Published: 8-Jun-2000; LatestRevisionDate: 17-Jul-2002; LatestRevisionNote: Re-released for DXP Platform.; PackageReference: AXIAL-0.3; Publisher: Altium Limited
R30F = Res1: Resistor; Published: 8-Jun-2000; LatestRevisionDate: 17-Jul-2002; LatestRevisionNote: Re-released for DXP Platform.; PackageReference: AXIAL-0.3; Publisher: Altium Limited; Value: 100k
U10F = LMR10515XSD: NatSemi 1.5A step-down regulator in LLP
U11F = SN74AUP1T98DBV: Single-supply voltage translator, multiple logic function
U12F = MT41J128M16HA-125: 2Gb DDR3-1600 SDRAM, 128Mb x 16, 1.25ns, 1.5V, 0 to 95 degC, 96-Ball FBGA, Pb-Free; Manufacturer: Micron; CL: CL = 11; Clock Rate: 800 MHz; Op. Temp.: 0C to +95C; DatasheetVersion: Rev. P; PackageVersion: Rev.E; PackageReference: MICT-HA-96; PackageDescription: 96-Ball Fine-Pitch Ball Grid Array, 14 x 9 mm, Pitch 0.8 mm; Cycle Time: 1.25ns; Data Rate: DDR3-1600; Density: 2Gb; Depth: 128Mb; Package: FBGA; Pin Count: 96-ball; RoHS: Yes; Voltage: 1.5V; Width: x16; Mounting Technology: Surface Mount; PartNumber: MT41J128M16HA-125; ComponentLink1Description: Manufacturer URL; ComponentLink1URL: http://www.micron.com/; ComponentLink2Description: Datasheet; ComponentLink2URL: http://www.micron.com/~/media/Documents/Products/Data%20Sheet/DRAM/2Gb_DDR3_SDRAM.pdf; ComponentLink3Description: Package Specification; ComponentLink3URL: http://www.micron.com/~/media/Documents/Products/Data%20Sheet/DRAM/4Gb_1_35V_DDR3L.pdf
U800 = XC6SLX9-2CSG324C: Spartan-6 LX 1.2V FPGA, 200 User I/Os, 324-Ball Chip-Scale BGA (0.8mm Pitch), Speed Grade 2, Commercial Grade, Pb-Free; FirstPublished: 17-Nov-2009; DatasheetVersion: ver1.3, Nov-2009; PackageVersion: ver1.0, Jun-2009; PackageReference: CSG324; Publisher: Altium Limited; PackageDescription: 324-Ball Chip-Scale BGA (CSG324) Package, 0.8 mm Pitch; Code_JEDEC: MO-275-KKAC-1; ComponentLink1Description: Spartan-6 Datasheet; ComponentLink1URL: http://www.xilinx.com/support/documentation/data_sheets/ds160.pdf; ComponentLink2Description: Pinout Specification; ComponentLink2URL: http://www.xilinx.com/support/documentation/user_guides/ug385.pdf; ComponentLink3Description: CSG324 Package Drawing; ComponentLink3URL: http://www.xilinx.com/support/documentation/package_specs/csg324.pdf; ComponentLink4Description: Spartan-6 Documents; ComponentLink4URL: http://www.xilinx.com/support/documentation/spartan-6.htm; ComponentLink5Description: Xilinx.com Home; ComponentLink5URL: http://www.xilinx.com